# Altium schematic sheet Schematic.SchDoc
size B; SheetNumber: 1; SheetTotal: 15
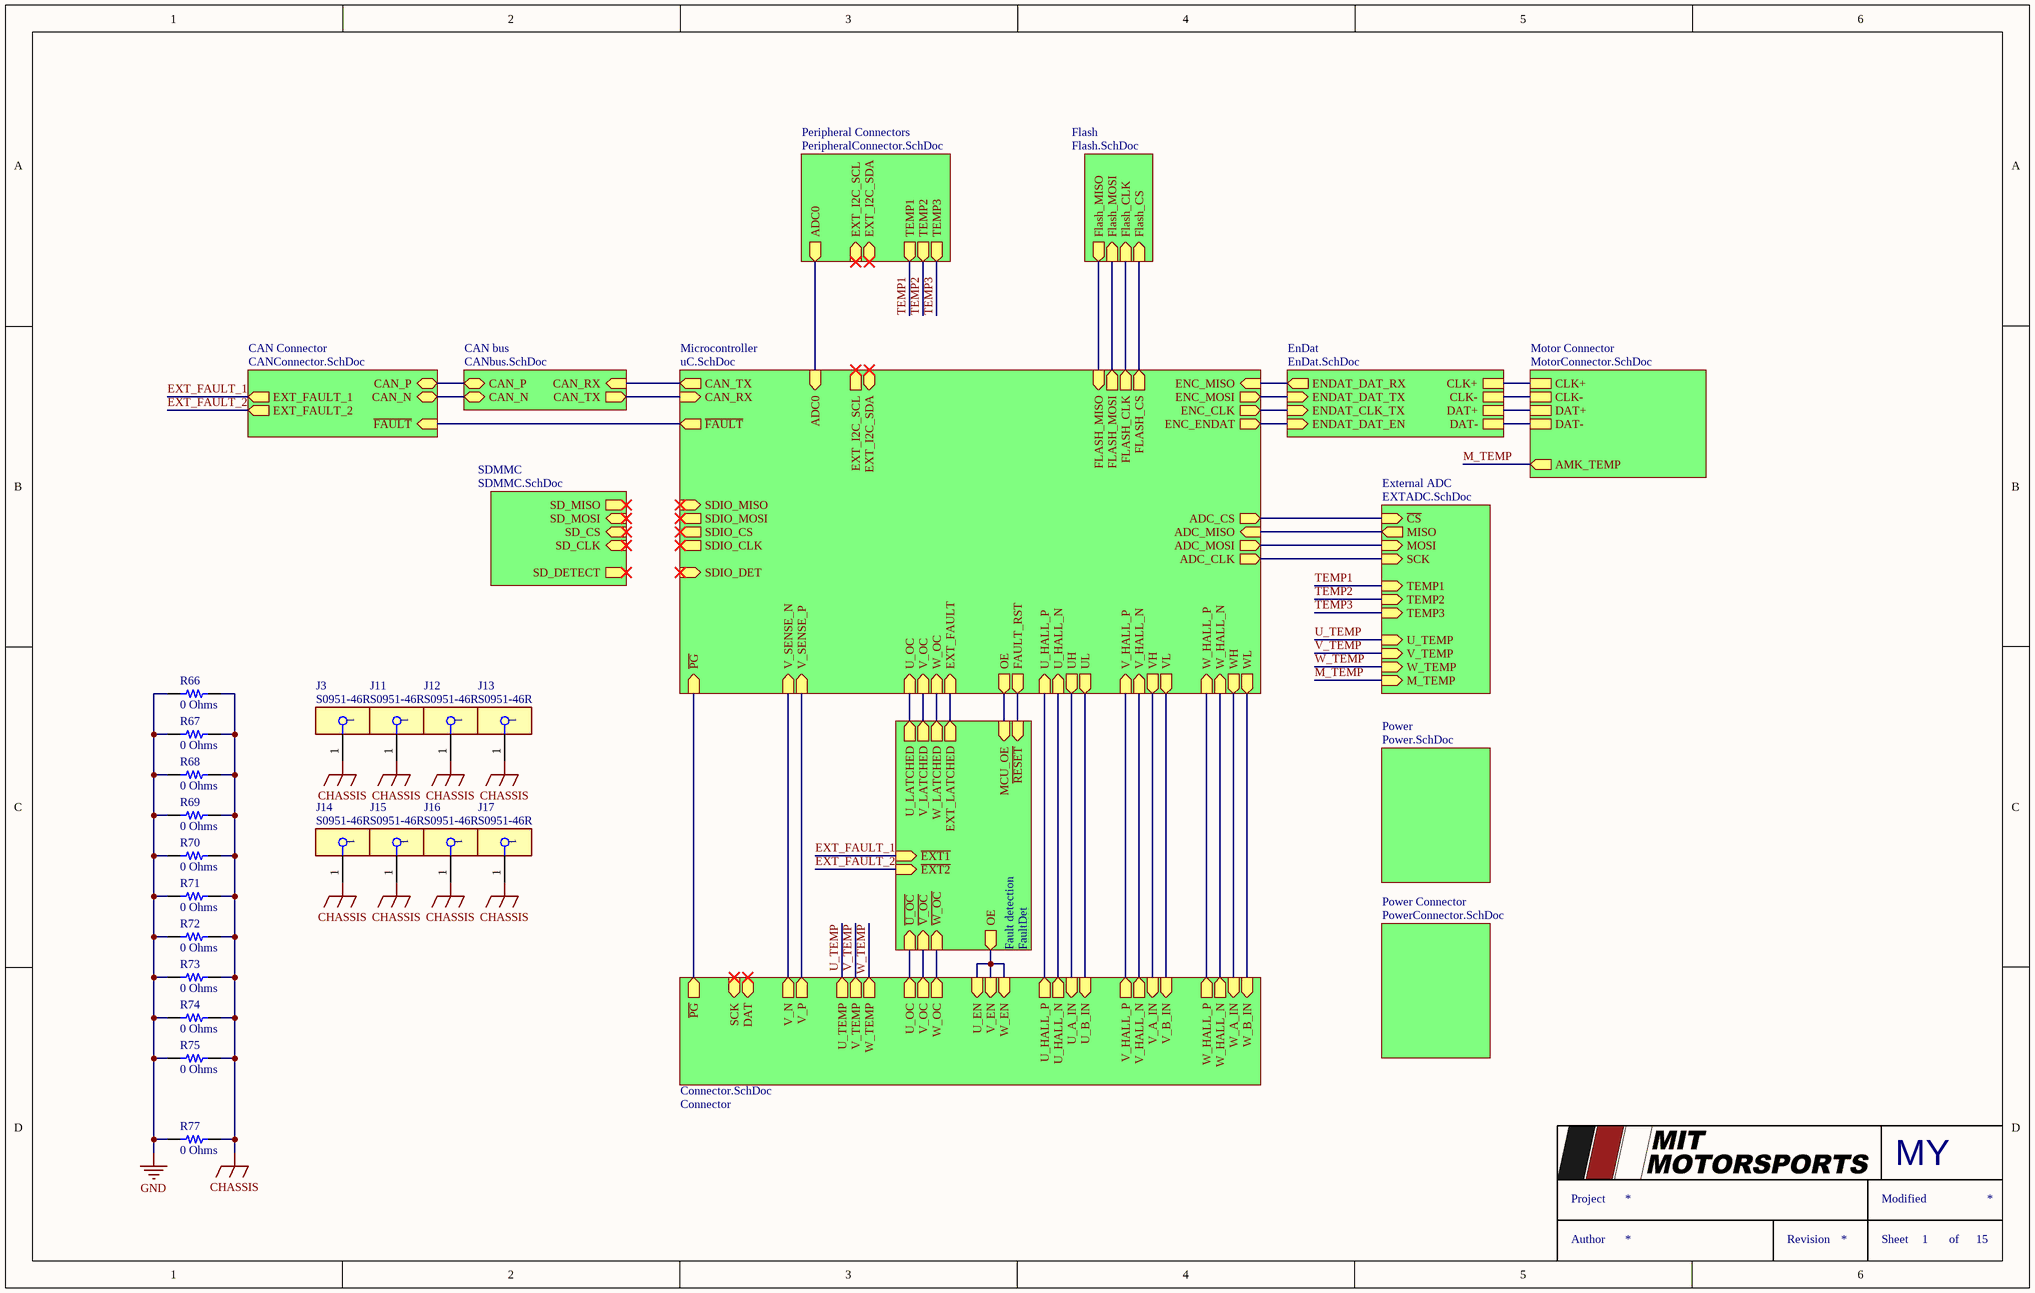
[diagram p0: Schematic.SchDoc]

## Parts
J3  S0951-46R  [FP-S0951-46R-MFG]
J11  S0951-46R  [FP-S0951-46R-MFG]
J12  S0951-46R  [FP-S0951-46R-MFG]
J13  S0951-46R  [FP-S0951-46R-MFG]
J14  S0951-46R  [FP-S0951-46R-MFG]
J15  S0951-46R  [FP-S0951-46R-MFG]
J16  S0951-46R  [FP-S0951-46R-MFG]
J17  S0951-46R  [FP-S0951-46R-MFG]
R66  0 Ohms  [RES 0402_1005]
R67  0 Ohms  [RES 0402_1005]
R68  0 Ohms  [RES 0402_1005]
R69  0 Ohms  [RES 0402_1005]
R70  0 Ohms  [RES 0402_1005]
R71  0 Ohms  [RES 0402_1005]
R72  0 Ohms  [RES 0402_1005]
R73  0 Ohms  [RES 0402_1005]
R74  0 Ohms  [RES 0402_1005]
R75  0 Ohms  [RES 0402_1005]
R77  0 Ohms  [RES 0402_1005]

## Sub-sheets
CAN bus = CANbus.SchDoc: CAN_N (bidir), CAN_P (bidir), CAN_RX (in), CAN_TX (out)
CAN Connector = CANConnector.SchDoc: ~{FAULT} (in), CAN_P (bidir), CAN_N (bidir), EXT_FAULT_1 (out), EXT_FAULT_2 (out)
Connector = Connector.SchDoc: W_HALL_N (out), W_HALL_P (out), W_A_IN (in), W_B_IN (in), V_A_IN (in), V_B_IN (in), V_HALL_N (out), V_HALL_P (out), U_HALL_P (out), U_HALL_N (out), U_B_IN (in), U_A_IN (in), U_OC (out), V_OC (out), W_OC (out), U_TEMP (out), V_TEMP (out), W_TEMP (out), V_N (out), V_P (out), SCK (in), DAT (bidir), ~{PG} (out), U_EN (in), V_EN (in), W_EN (in)
EnDat = EnDat.SchDoc: ENDAT_DAT_RX (out), ENDAT_DAT_EN (in), ENDAT_DAT_TX (in), ENDAT_CLK_TX (in), CLK-, CLK+, DAT+, DAT-
External ADC = EXTADC.SchDoc: ~{CS} (in), MISO (out), MOSI (in), SCK (in), TEMP1 (in), TEMP2 (in), TEMP3 (in), U_TEMP (in), V_TEMP (in), W_TEMP (in), M_TEMP (in)
Fault detection = FaultDet: MCU_OE (in), OE (out), EXT_LATCHED (out), U_LATCHED (out), V_LATCHED (out), W_LATCHED (out), ~{W_OC} (in), ~{V_OC} (in), ~{U_OC} (in), ~{RESET} (in), ~{EXT1} (in), ~{EXT2} (in)
Flash = Flash.SchDoc: Flash_CS (in), Flash_MISO (out), Flash_CLK (in), Flash_MOSI (in)
Microcontroller = uC.SchDoc: CAN_TX (out), CAN_RX (in), ~{FAULT} (out), SDIO_MISO (in), SDIO_MOSI (out), SDIO_CS (out), SDIO_CLK (out), UH (out), UL (out), U_HALL_P (in), U_HALL_N (in), WH (out), WL (out), W_HALL_P (in), W_HALL_N (in), VH (out), VL (out), V_HALL_P (in), V_HALL_N (in), U_OC (in), V_OC (in), W_OC (in), V_SENSE_N (in), V_SENSE_P (in), ~{PG} (in), EXT_I2C_SCL (out), EXT_I2C_SDA (bidir), ADC_MOSI (out), ADC_MISO (in), ADC_CLK (out), ADC_CS (out), OE (out), ENC_MISO (in), ENC_MOSI (out), ENC_CLK (out), ENC_ENDAT (out), EXT_FAULT (in), FAULT_RST (out), SDIO_DET (in), FLASH_MISO (in), FLASH_MOSI (out), FLASH_CLK (out), FLASH_CS (out), ADC0 (in)
Motor Connector = MotorConnector.SchDoc: AMK_TEMP (out), CLK+, CLK-, DAT+, DAT-
Peripheral Connectors = PeripheralConnector.SchDoc: ADC0 (out), TEMP1 (out), TEMP2 (out), TEMP3 (out), EXT_I2C_SCL (in), EXT_I2C_SDA (bidir)
Power = Power.SchDoc: no entries
Power Connector = PowerConnector.SchDoc: no entries
SDMMC = SDMMC.SchDoc: SD_DETECT (out), SD_MISO (out), SD_CS (in), SD_MOSI (in), SD_CLK (in)

## Nets
CHASSIS: J3.1 J11.1 J12.1 J13.1 J14.1 J15.1 J16.1 J17.1 R66.2 R67.2 R68.2 R69.2 R70.2 R71.2 R72.2 R73.2 R74.2 R75.2 R77.2
GND: R66.1 R67.1 R68.1 R69.1 R70.1 R71.1 R72.1 R73.1 R74.1 R75.1 R77.1
EXT_FAULT_1: sheet CAN Connector/EXT_FAULT_1, sheet Fault detection/~{EXT1}
EXT_FAULT_2: sheet CAN Connector/EXT_FAULT_2, sheet Fault detection/~{EXT2}
M_TEMP: sheet Motor Connector/AMK_TEMP, sheet External ADC/M_TEMP
TEMP1: sheet Peripheral Connectors/TEMP1, sheet External ADC/TEMP1
TEMP2: sheet Peripheral Connectors/TEMP2, sheet External ADC/TEMP2
TEMP3: sheet Peripheral Connectors/TEMP3, sheet External ADC/TEMP3
U_TEMP: sheet Connector/U_TEMP, sheet External ADC/U_TEMP
V_TEMP: sheet Connector/V_TEMP, sheet External ADC/V_TEMP
W_TEMP: sheet Connector/W_TEMP, sheet External ADC/W_TEMP
(unnamed): sheet CAN bus/CAN_N, sheet CAN Connector/CAN_N
(unnamed): sheet CAN bus/CAN_P, sheet CAN Connector/CAN_P
(unnamed): sheet CAN bus/CAN_RX, sheet Microcontroller/CAN_TX
(unnamed): sheet CAN bus/CAN_TX, sheet Microcontroller/CAN_RX
(unnamed): sheet Microcontroller/~{FAULT}, sheet CAN Connector/~{FAULT}
(unnamed): sheet Microcontroller/UH, sheet Connector/U_A_IN
(unnamed): sheet Microcontroller/UL, sheet Connector/U_B_IN
(unnamed): sheet Microcontroller/U_HALL_P, sheet Connector/U_HALL_P
(unnamed): sheet Microcontroller/U_HALL_N, sheet Connector/U_HALL_N
(unnamed): sheet Microcontroller/WH, sheet Connector/W_A_IN
(unnamed): sheet Microcontroller/WL, sheet Connector/W_B_IN
(unnamed): sheet Microcontroller/W_HALL_P, sheet Connector/W_HALL_P
(unnamed): sheet Microcontroller/W_HALL_N, sheet Connector/W_HALL_N
(unnamed): sheet Microcontroller/VH, sheet Connector/V_A_IN
(unnamed): sheet Microcontroller/VL, sheet Connector/V_B_IN
(unnamed): sheet Microcontroller/V_HALL_P, sheet Connector/V_HALL_P
(unnamed): sheet Microcontroller/V_HALL_N, sheet Connector/V_HALL_N
(unnamed): sheet Microcontroller/U_OC, sheet Fault detection/U_LATCHED
(unnamed): sheet Microcontroller/V_OC, sheet Fault detection/V_LATCHED
(unnamed): sheet Microcontroller/W_OC, sheet Fault detection/W_LATCHED
(unnamed): sheet Microcontroller/V_SENSE_N, sheet Connector/V_N
(unnamed): sheet Microcontroller/V_SENSE_P, sheet Connector/V_P
(unnamed): sheet Microcontroller/~{PG}, sheet Connector/~{PG}
(unnamed): sheet Microcontroller/ADC_MOSI, sheet External ADC/MOSI
(unnamed): sheet Microcontroller/ADC_MISO, sheet External ADC/MISO
(unnamed): sheet Microcontroller/ADC_CLK, sheet External ADC/SCK
(unnamed): sheet Microcontroller/ADC_CS, sheet External ADC/~{CS}
(unnamed): sheet Microcontroller/OE, sheet Fault detection/MCU_OE
(unnamed): sheet Microcontroller/ENC_MISO, sheet EnDat/ENDAT_DAT_RX
(unnamed): sheet Microcontroller/ENC_MOSI, sheet EnDat/ENDAT_DAT_TX
(unnamed): sheet Microcontroller/ENC_CLK, sheet EnDat/ENDAT_CLK_TX
(unnamed): sheet Microcontroller/ENC_ENDAT, sheet EnDat/ENDAT_DAT_EN
(unnamed): sheet Microcontroller/EXT_FAULT, sheet Fault detection/EXT_LATCHED
(unnamed): sheet Microcontroller/FAULT_RST, sheet Fault detection/~{RESET}
(unnamed): sheet Microcontroller/FLASH_MISO, sheet Flash/Flash_MISO
(unnamed): sheet Microcontroller/FLASH_MOSI, sheet Flash/Flash_MOSI
(unnamed): sheet Microcontroller/FLASH_CLK, sheet Flash/Flash_CLK
(unnamed): sheet Microcontroller/FLASH_CS, sheet Flash/Flash_CS
(unnamed): sheet Microcontroller/ADC0, sheet Peripheral Connectors/ADC0
(unnamed): sheet Connector/U_OC, sheet Fault detection/~{U_OC}
(unnamed): sheet Connector/V_OC, sheet Fault detection/~{V_OC}
(unnamed): sheet Connector/W_OC, sheet Fault detection/~{W_OC}
(unnamed): sheet Connector/U_EN, sheet Connector/V_EN, sheet Connector/W_EN, sheet Fault detection/OE
(unnamed): sheet Motor Connector/CLK+, sheet EnDat/CLK+
(unnamed): sheet Motor Connector/CLK-, sheet EnDat/CLK-
(unnamed): sheet Motor Connector/DAT+, sheet EnDat/DAT+
(unnamed): sheet Motor Connector/DAT-, sheet EnDat/DAT-

## Notes on the sheet
- MY
- Project
- Author
- Revision
- Sheet
- Modified
- of

## Library data of the parts
J3 J11-J17 = CMP-15817-000012-1: RFI SHIELD CLIP MINI TIN SMD; Width: 0.04inch; Min Operating Temperature: -40°C; Max Operating Temperature: 185°C; Thickness: 0.051inch; REACH SVHC: No SVHC; Length: 0.155inch
R66-R75 R77 = RCC04020000Z0ED: RCC0402 0R0 ET7 E3; Manufacturer: Vishay Dale; Power (Watts): 0.125W, 1/8W; Tolerance: Jumper; Part Number: RCC04020000Z0ED; Value: 0 Ohms; ComponentLink1Description: Datasheet; ComponentLink1URL: https://www.vishay.com/docs/20066/rcce3.pdf; ComponentLink2Description: DigiKey Link; ComponentLink2URL: https://www.digikey.com/en/products/detail/vishay-dale/RCC04020000Z0ED/12084253; Composition: Thick Film; Device Package: 0402 (1005 Metric); Features: Automotive AEC-Q200; Height - Seated (Max): 0.016" (0.40mm); LastUpdated: 2/9/2024 8:28:54 PM; Lifecycle Status: Active; Minimum Order: 1; Number of Terminations: 2; Operating Temperature: -55°C ~ 155°C; Package / Case: 0402 (1005 Metric); Packaging: TapeAndReel; PartId: 66958; Part Status: Active; Price: 0.01; Ratings: AEC-Q200; Resistance: 0 Ohms; Series: RCC e3; Size / Dimension: 0.039" L x 0.020" W (1.00mm x 0.50mm); Supplier 1: DigiKey; Supplier Part Number 1: 541-RCC04020000Z0EDCT-ND; Supplier Device Package: 0402